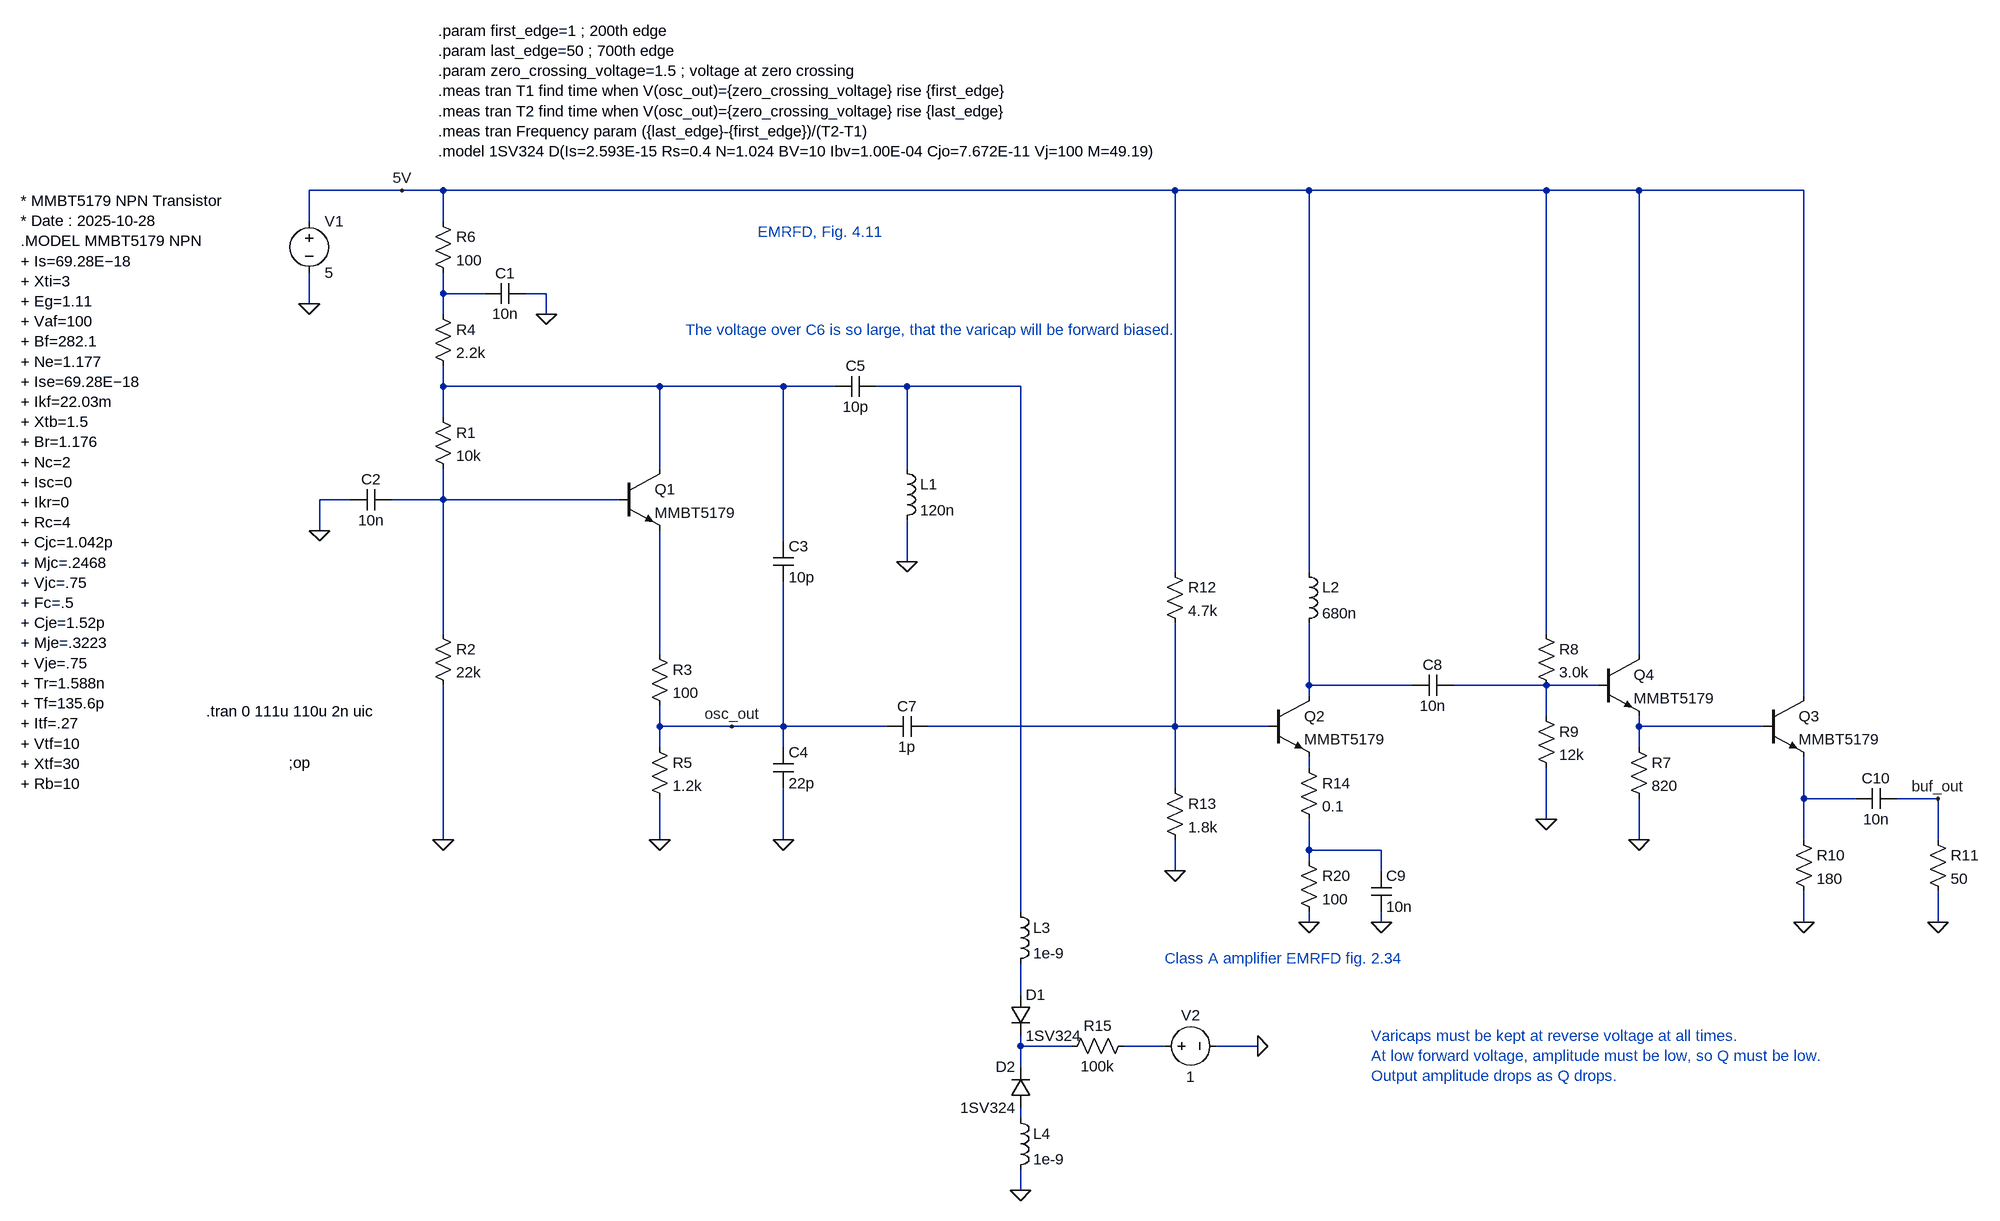
[diagram p0: schematic Seiler.asc]
Seiler.asc, the LTspice schematic file:
Version 4
SHEET 1 4164 1668
WIRE -16 -320 -160 -320
WIRE 48 -320 -16 -320
WIRE 1184 -320 48 -320
WIRE 1392 -320 1184 -320
WIRE 1760 -320 1392 -320
WIRE 1904 -320 1760 -320
WIRE 2160 -320 1904 -320
WIRE -160 -272 -160 -320
WIRE 48 -272 48 -320
WIRE 48 -160 48 -192
WIRE 112 -160 48 -160
WIRE 208 -160 176 -160
WIRE -160 -144 -160 -192
WIRE 48 -128 48 -160
WIRE 208 -128 208 -160
WIRE 48 -16 48 -48
WIRE 384 -16 48 -16
WIRE 576 -16 384 -16
WIRE 656 -16 576 -16
WIRE 768 -16 720 -16
WIRE 944 -16 768 -16
WIRE 48 32 48 -16
WIRE 384 112 384 -16
WIRE 768 112 768 -16
WIRE -96 160 -144 160
WIRE 48 160 48 112
WIRE 48 160 -32 160
WIRE 320 160 48 160
WIRE -144 208 -144 160
WIRE 576 224 576 -16
WIRE 768 256 768 192
WIRE 1184 272 1184 -320
WIRE 1392 272 1392 -320
WIRE 48 368 48 160
WIRE 1760 368 1760 -320
WIRE 384 400 384 208
WIRE 1904 400 1904 -320
WIRE 1392 448 1392 352
WIRE 1552 448 1392 448
WIRE 1760 448 1616 448
WIRE 1840 448 1760 448
WIRE 1392 464 1392 448
WIRE 2160 464 2160 -320
WIRE 1760 496 1760 448
WIRE 384 512 384 480
WIRE 496 512 384 512
WIRE 576 512 576 288
WIRE 576 512 496 512
WIRE 736 512 576 512
WIRE 1184 512 1184 352
WIRE 1184 512 800 512
WIRE 1328 512 1184 512
WIRE 1904 512 1904 496
WIRE 2096 512 1904 512
WIRE 384 544 384 512
WIRE 576 544 576 512
WIRE 1904 544 1904 512
WIRE 1392 576 1392 560
WIRE 1184 608 1184 512
WIRE 2160 624 2160 560
WIRE 2240 624 2160 624
WIRE 2368 624 2304 624
WIRE 1760 656 1760 576
WIRE 48 688 48 448
WIRE 384 688 384 624
WIRE 576 688 576 608
WIRE 1904 688 1904 624
WIRE 2160 688 2160 624
WIRE 2368 688 2368 624
WIRE 1392 704 1392 656
WIRE 1504 704 1392 704
WIRE 1392 720 1392 704
WIRE 1184 736 1184 688
WIRE 1504 736 1504 704
WIRE 944 800 944 -16
WIRE 1392 816 1392 800
WIRE 1504 816 1504 800
WIRE 2160 816 2160 768
WIRE 2368 816 2368 768
WIRE 944 928 944 880
WIRE 944 1008 944 992
WIRE 1024 1008 944 1008
WIRE 1168 1008 1104 1008
WIRE 1312 1008 1248 1008
WIRE 944 1040 944 1008
WIRE 944 1120 944 1104
WIRE 944 1232 944 1200
FLAG -160 -144 0
FLAG 48 688 0
FLAG 384 688 0
FLAG -144 208 0
FLAG 208 -128 0
FLAG 576 688 0
FLAG 768 256 0
FLAG 496 512 osc_out
FLAG -16 -320 5V
FLAG 1184 736 0
FLAG 1392 816 0
FLAG 1504 816 0
FLAG 1904 688 0
FLAG 1760 656 0
FLAG 2160 816 0
FLAG 2368 816 0
FLAG 2368 624 buf_out
FLAG 1312 1008 0
FLAG 944 1232 0
DATAFLAG 336 -16 ""
DATAFLAG 384 304 ""
DATAFLAG 192 160 ""
DATAFLAG 1504 448 ""
DATAFLAG 1184 512 ""
DATAFLAG 2016 512 ""
SYMBOL res 32 16 R0
SYMATTR InstName R1
SYMATTR Value 10k
SYMBOL res 32 352 R0
SYMATTR InstName R2
SYMATTR Value 22k
SYMBOL res 368 384 R0
SYMATTR InstName R3
SYMATTR Value 100
SYMBOL res 32 -144 R0
SYMATTR InstName R4
SYMATTR Value 2.2k
SYMBOL res 368 528 R0
SYMATTR InstName R5
SYMATTR Value 1.2k
SYMBOL res 32 -288 R0
SYMATTR InstName R6
SYMATTR Value 100
SYMBOL voltage -160 -288 R0
SYMATTR InstName V1
SYMATTR Value 5
SYMBOL cap 176 -176 R90
WINDOW 0 0 32 VBottom 2
WINDOW 3 32 32 VTop 2
SYMATTR InstName C1
SYMATTR Value 10n
SYMBOL cap -32 144 R90
WINDOW 0 0 32 VBottom 2
WINDOW 3 32 32 VTop 2
SYMATTR InstName C2
SYMATTR Value 10n
SYMBOL cap 560 224 R0
SYMATTR InstName C3
SYMATTR Value 10p
SYMBOL cap 560 544 R0
SYMATTR InstName C4
SYMATTR Value 22p
SYMBOL cap 720 -32 R90
WINDOW 0 0 32 VBottom 2
WINDOW 3 32 32 VTop 2
SYMATTR InstName C5
SYMATTR Value 10p
SYMBOL ind 752 96 R0
SYMATTR InstName L1
SYMATTR Value 120n
SYMBOL cap 800 496 R90
WINDOW 0 0 32 VBottom 2
WINDOW 3 32 32 VTop 2
SYMATTR InstName C7
SYMATTR Value 1p
SYMBOL res 1168 256 R0
SYMATTR InstName R12
SYMATTR Value 4.7k
SYMBOL res 1168 592 R0
SYMATTR InstName R13
SYMATTR Value 1.8k
SYMBOL res 1376 704 R0
SYMATTR InstName R20
SYMATTR Value 100
SYMBOL cap 1488 736 R0
SYMATTR InstName C9
SYMATTR Value 10n
SYMBOL ind 1376 256 R0
SYMATTR InstName L2
SYMATTR Value 680n
SYMATTR SpiceLine Rser=0.1
SYMBOL npn 320 112 R0
SYMATTR InstName Q1
SYMATTR Value MMBT5179
SYMBOL npn 1328 464 R0
SYMATTR InstName Q2
SYMATTR Value MMBT5179
SYMBOL npn 2096 464 R0
SYMATTR InstName Q3
SYMATTR Value MMBT5179
SYMBOL npn 1840 400 R0
SYMATTR InstName Q4
SYMATTR Value MMBT5179
SYMBOL res 1888 528 R0
SYMATTR InstName R7
SYMATTR Value 820
SYMBOL res 1744 352 R0
SYMATTR InstName R8
SYMATTR Value 3.0k
SYMBOL res 1744 480 R0
SYMATTR InstName R9
SYMATTR Value 12k
SYMBOL res 2144 672 R0
SYMATTR InstName R10
SYMATTR Value 180
SYMBOL cap 1616 432 R90
WINDOW 0 0 32 VBottom 2
WINDOW 3 32 32 VTop 2
SYMATTR InstName C8
SYMATTR Value 10n
SYMBOL res 2352 672 R0
SYMATTR InstName R11
SYMATTR Value 50
SYMBOL cap 2304 608 R90
WINDOW 0 0 32 VBottom 2
WINDOW 3 32 32 VTop 2
SYMATTR InstName C10
SYMATTR Value 10n
SYMBOL res 1376 560 R0
SYMATTR InstName R14
SYMATTR Value 0.1
SYMBOL res 1008 1024 R270
WINDOW 0 32 56 VTop 2
WINDOW 3 0 56 VBottom 2
SYMATTR InstName R15
SYMATTR Value 100k
SYMBOL voltage 1152 1008 R270
WINDOW 0 32 56 VTop 2
WINDOW 3 -32 56 VBottom 2
SYMATTR InstName V2
SYMATTR Value 1
SYMBOL diode 928 928 R0
SYMATTR InstName D1
SYMATTR Value 1SV324
SYMBOL diode 960 1104 R180
WINDOW 0 24 64 Left 2
WINDOW 3 24 0 Left 2
SYMATTR InstName D2
SYMATTR Value 1SV324
SYMBOL ind 928 784 R0
SYMATTR InstName L3
SYMATTR Value 1e-9
SYMBOL ind 928 1104 R0
SYMATTR InstName L4
SYMATTR Value 1e-9
TEXT -192 568 Left 2 !;op
TEXT 536 -256 Left 2 ;EMRFD, Fig. 4.11
TEXT -320 488 Left 2 !.tran 0 111u 110u 2n uic
TEXT 40 -568 Left 2 !.param first_edge=1 ; 200th edge\n.param last_edge=50 ; 700th edge\n.param zero_crossing_voltage=1.5 ; voltage at zero crossing\n.meas tran T1 find time when V(osc_out)={zero_crossing_voltage} rise {first_edge}\n.meas tran T2 find time when V(osc_out)={zero_crossing_voltage} rise {last_edge}\n.meas tran Frequency param ({last_edge}-{first_edge})/(T2-T1)\n.model 1SV324 D(Is=2.593E-15 Rs=0.4 N=1.024 BV=10 Ibv=1.00E-04 Cjo=7.672E-11 Vj=100 M=49.19)
TEXT 1168 872 Left 2 ;Class A amplifier EMRFD fig. 2.34
TEXT -608 -304 Left 2 !* MMBT5179 NPN Transistor\n* Date : 2025-10-28\n.MODEL MMBT5179 NPN\n+ Is=69.28E−18 \n+ Xti=3 \n+ Eg=1.11 \n+ Vaf=100 \n+ Bf=282.1 \n+ Ne=1.177 \n+ Ise=69.28E−18 \n+ Ikf=22.03m \n+ Xtb=1.5 \n+ Br=1.176 \n+ Nc=2 \n+ Isc=0 \n+ Ikr=0 \n+ Rc=4 \n+ Cjc=1.042p \n+ Mjc=.2468 \n+ Vjc=.75 \n+ Fc=.5 \n+ Cje=1.52p \n+ Mje=.3223 \n+ Vje=.75 \n+ Tr=1.588n \n+ Tf=135.6p \n+ Itf=.27 \n+ Vtf=10 \n+ Xtf=30 \n+ Rb=10
TEXT 424 -104 Left 2 ;The voltage over C6 is so large, that the varicap will be forward biased.
TEXT 1488 992 Left 2 ;Varicaps must be kept at reverse voltage at all times.\nAt low forward voltage, amplitude must be low, so Q must be low.\nOutput amplitude drops as Q drops.

The netlist it stands for:
* Seiler.asc
R1 N002 N004 10k
R2 N004 0 22k
R3 N005 osc_out 100
R4 N001 N002 2.2k
R5 osc_out 0 1.2k
R6 5V N001 100
V1 5V 0 5
C1 0 N001 10n
C2 N004 0 10n
C3 N002 osc_out 10p
C4 osc_out 0 22p
C5 N003 N002 10p
L1 N003 0 120n
C7 N008 osc_out 1p
R12 5V N008 4.7k
R13 N008 0 1.8k
R20 N012 0 100
C9 N012 0 10n
L2 5V N006 680n Rser=0.1
Q1 N002 N004 N005 0 MMBT5179
Q2 N006 N008 N010 0 MMBT5179
Q3 5V N009 N011 0 MMBT5179
Q4 5V N007 N009 0 MMBT5179
R7 N009 0 820
R8 5V N007 3.0k
R9 N007 0 12k
R10 N011 0 180
C8 N007 N006 10n
R11 buf_out 0 50
C10 buf_out N011 10n
R14 N010 N012 0.1
R15 N014 N015 100k
V2 N015 0 1
D1 N013 N014 1SV324
D2 N016 N014 1SV324
L3 N003 N013 1e-9
L4 N016 0 1e-9
.model D D
.lib standard.dio
.model NPN NPN
.model PNP PNP
.lib standard.bjt
;op
* EMRFD, Fig. 4.11
.tran 0 111u 110u 2n uic
.param first_edge=1 ; 200th edge
.param last_edge=50 ; 700th edge
.param zero_crossing_voltage=1.5 ; voltage at zero crossing
.meas tran T1 find time when V(osc_out)={zero_crossing_voltage} rise {first_edge}
.meas tran T2 find time when V(osc_out)={zero_crossing_voltage} rise {last_edge}
.meas tran Frequency param ({last_edge}-{first_edge})/(T2-T1)
.model 1SV324 D(Is=2.593E-15 Rs=0.4 N=1.024 BV=10 Ibv=1.00E-04 Cjo=7.672E-11 Vj=100 M=49.19)
* Class A amplifier EMRFD fig. 2.34
* MMBT5179 NPN Transistor
* Date : 2025-10-28
.MODEL MMBT5179 NPN
+ Is=69.28E−18
+ Xti=3
+ Eg=1.11
+ Vaf=100
+ Bf=282.1
+ Ne=1.177
+ Ise=69.28E−18
+ Ikf=22.03m
+ Xtb=1.5
+ Br=1.176
+ Nc=2
+ Isc=0
+ Ikr=0
+ Rc=4
+ Cjc=1.042p
+ Mjc=.2468
+ Vjc=.75
+ Fc=.5
+ Cje=1.52p
+ Mje=.3223
+ Vje=.75
+ Tr=1.588n
+ Tf=135.6p
+ Itf=.27
+ Vtf=10
+ Xtf=30
+ Rb=10
* The voltage over C6 is so large, that the varicap will be forward biased.
* Varicaps must be kept at reverse voltage at all times.
* At low forward voltage, amplitude must be low, so Q must be low.
* Output amplitude drops as Q drops.
.backanno
.end